# EAGLE schematic EEprog (EAGLE 7.0.0)
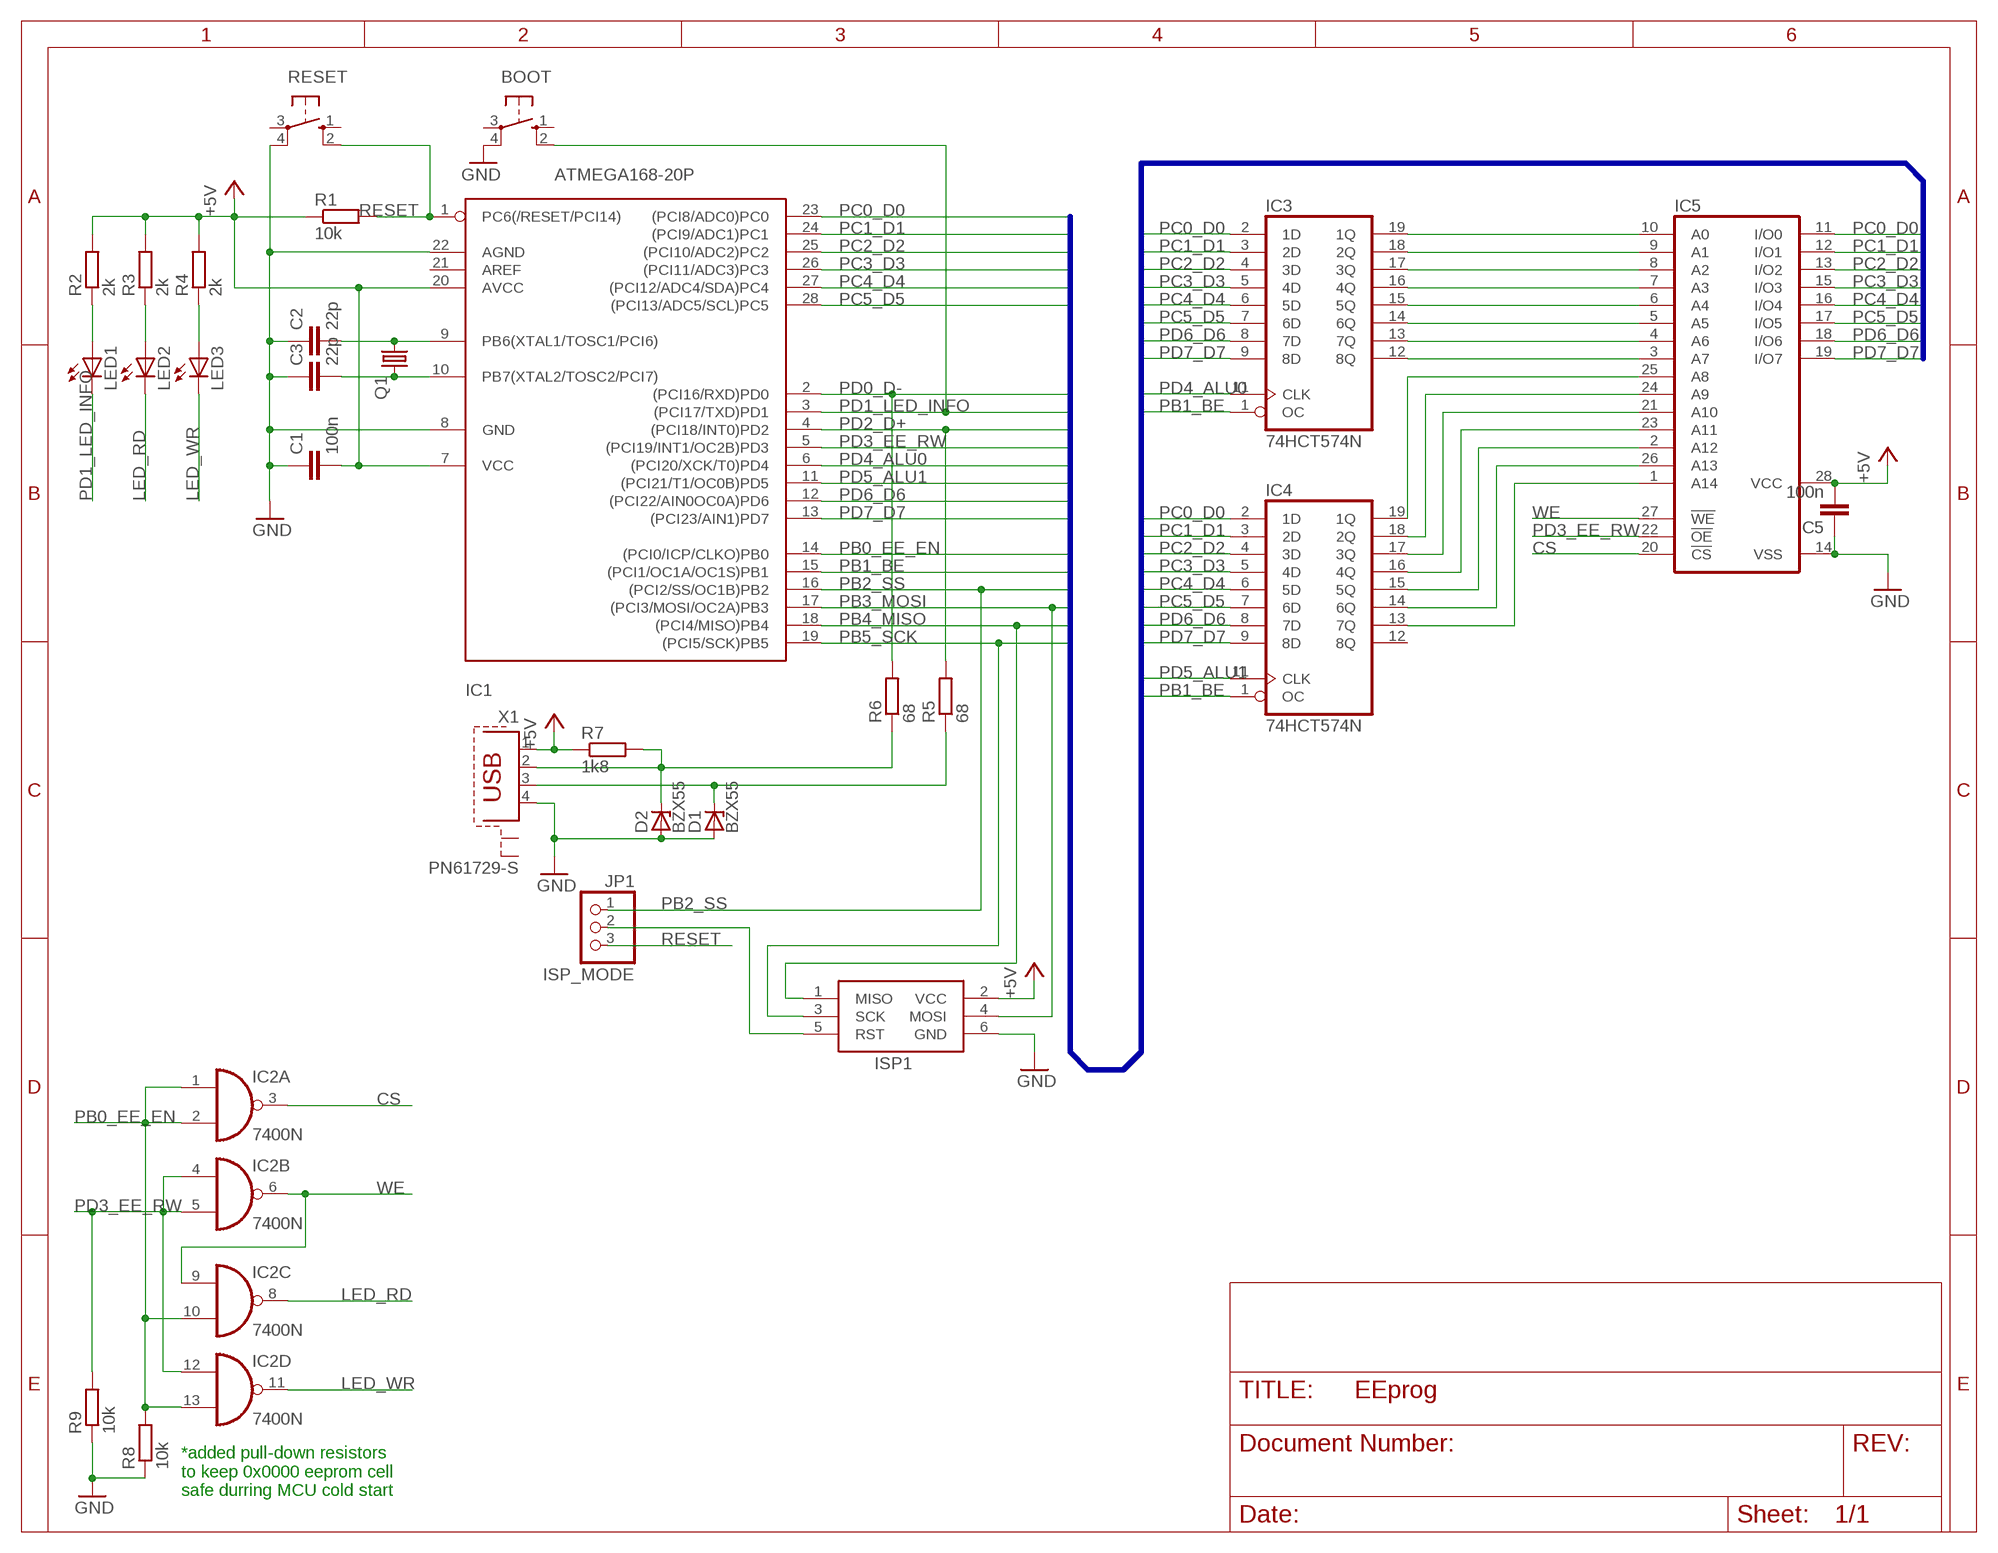
[diagram p0: schematic, sheet 1]

## Parts
BOOT  10-XX  [B3F-10XX]
C1  100n  C-EU025-025X050  [C025-025X050]
C2  22p  C-EU025-025X050  [C025-025X050]
C3  22p  C-EU025-025X050  [C025-025X050]
C5  100n  C-EU025-025X050  [C025-025X050]
D1  BZX55  [DO35Z10]
D2  BZX55  [DO35Z10]
IC1  ATMEGA168-20P  [DIL28-3]
IC2  7400N  [DIL14]
IC3  74HCT574N  [DIL20]
IC4  74HCT574N  [DIL20]
IC5  62256P  [DIL28-6]
ISP1  AVRISP-BOX  [AVRISP-BOX]
JP1  ISP_MODE  PINHD-1X3  [1X03]
LED1  LED3MM  [LED3MM]
LED2  LED3MM  [LED3MM]
LED3  LED3MM  [LED3MM]
Q1  CRYSTALHC49S  [HC49/S]
R1  10k  R-EU_0204/7  [0204/7]
R2  2k  R-EU_0204/7  [0204/7]
R3  2k  R-EU_0204/7  [0204/7]
R4  2k  R-EU_0204/7  [0204/7]
R5  68  R-EU_0204/7  [0204/7]
R6  68  R-EU_0204/7  [0204/7]
R7  1k8  R-EU_0204/7  [0204/7]
R8  10k  R-EU_0204/7  [0204/7]
R9  10k  R-EU_0204/7  [0204/7]
RESET  10-XX  [B3F-10XX]
X1  PN61729-S  [PN61729-S]

## Nets
+5V: C1.2 C5.2 IC1.7(VCC) IC1.20(AVCC) IC5.28(VCC) ISP1.2(VCC) R1.1 R2.2 R3.2 R4.2 R7.1 X1.1
CS: IC2.3(A:O) IC5.20(!CS)
GND: BOOT.4(P1) C1.1 C2.1 C3.1 C5.1 D1.A D2.A IC1.8(GND) IC1.22(AGND) IC5.14(VSS) ISP1.6(GND) R8.1 R9.1 RESET.4(P1) X1.4
LED_RD: IC2.8(C:O) LED2.K(C)
LED_WR: IC2.11(D:O) LED3.K(C)
N$1: IC3.19(1Q) IC5.10(A0)
N$2: IC3.18(2Q) IC5.9(A1)
N$3: IC3.17(3Q) IC5.8(A2)
N$4: IC3.16(4Q) IC5.7(A3)
N$5: IC3.15(5Q) IC5.6(A4)
N$6: IC3.14(6Q) IC5.5(A5)
N$7: IC3.13(7Q) IC5.4(A6)
N$8: IC3.12(8Q) IC5.3(A7)
N$9: IC4.19(1Q) IC5.25(A8)
N$10: IC4.18(2Q) IC5.24(A9)
N$11: IC4.17(3Q) IC5.21(A10)
N$12: IC4.16(4Q) IC5.23(A11)
N$13: IC4.15(5Q) IC5.2(A12)
N$14: IC4.14(6Q) IC5.26(A13)
N$15: IC4.13(7Q) IC5.1(A14)
N$16: D2.C R6.1 R7.2 X1.2
N$17: LED1.A R2.1
N$18: C2.2 IC1.9(PB6(XTAL1/TOSC1/PCI6)) Q1.1
N$19: C3.2 IC1.10(PB7(XTAL2/TOSC2/PCI7)) Q1.2
N$20: ISP1.5(RST) JP1.2
N$21: D1.C R5.1 X1.3
N$22: LED2.A R3.1
N$24: LED3.A R4.1
PB0_EE_EN: IC1.14((PCI0/ICP/CLKO)PB0) IC2.1(A:I0) IC2.2(A:I1) IC2.10(C:I1) IC2.13(D:I1) R8.2
PB1_BE: IC1.15((PCI1/OC1A/OC1S)PB1) IC3.1(OC) IC4.1(OC)
PB2_SS: IC1.16((PCI2/SS/OC1B)PB2) JP1.1
PB3_MOSI: IC1.17((PCI3/MOSI/OC2A)PB3) ISP1.4(MOSI)
PB4_MISO: IC1.18((PCI4/MISO)PB4) ISP1.1(MISO)
PB5_SCK: IC1.19((PCI5/SCK)PB5) ISP1.3(SCK)
PC0_D0: IC1.23((PCI8/ADC0)PC0) IC3.2(1D) IC4.2(1D) IC5.11(I/O0)
PC1_D1: IC1.24((PCI9/ADC1)PC1) IC3.3(2D) IC4.3(2D) IC5.12(I/O1)
PC2_D2: IC1.25((PCI10/ADC2)PC2) IC3.4(3D) IC4.4(3D) IC5.13(I/O2)
PC3_D3: IC1.26((PCI11/ADC3)PC3) IC3.5(4D) IC4.5(4D) IC5.15(I/O3)
PC4_D4: IC1.27((PCI12/ADC4/SDA)PC4) IC3.6(5D) IC4.6(5D) IC5.16(I/O4)
PC5_D5: IC1.28((PCI13/ADC5/SCL)PC5) IC3.7(6D) IC4.7(6D) IC5.17(I/O5)
PD0_D-: IC1.2((PCI16/RXD)PD0) R6.2
PD1_LED_INFO: BOOT.2(S1) IC1.3((PCI17/TXD)PD1) LED1.K(C)
PD2_D+: IC1.4((PCI18/INT0)PD2) R5.2
PD3_EE_RW: IC1.5((PCI19/INT1/OC2B)PD3) IC2.4(B:I0) IC2.5(B:I1) IC2.12(D:I0) IC5.22(!OE) R9.2
PD4_ALU0: IC1.6((PCI20/XCK/T0)PD4) IC3.11(CLK)
PD5_ALU1: IC1.11((PCI21/T1/OC0B)PD5) IC4.11(CLK)
PD6_D6: IC1.12((PCI22/AIN0OC0A)PD6) IC3.8(7D) IC4.8(7D) IC5.18(I/O6)
PD7_D7: IC1.13((PCI23/AIN1)PD7) IC3.9(8D) IC4.9(8D) IC5.19(I/O7)
RESET: IC1.1(PC6(/RESET/PCI14)) JP1.3 R1.2 RESET.2(S1)
WE: IC2.6(B:O) IC2.9(C:I0) IC5.27(!WE)
Unconnected: BOOT.1(S) BOOT.3(P) IC1.21(AREF) IC4.12(8Q) RESET.1(S) RESET.3(P) X1.S1 X1.S2

## Buses
D[0..7],CE,OE,WE,PB[0..5],PC[0..5],PD[0..7],ALU0,ALU1

## Notes on the sheet
- *added pull-down resistors 
  to keep 0x0000 eeprom cell
  safe durring MCU cold start

## Power pins joined to a net without a drawn wire
GND: IC2.7(P:GND) IC3.10(GND) IC4.10(GND)
VCC: IC2.14(P:VCC) IC3.20(VCC) IC4.20(VCC)

## Library data of the parts
BOOT RESET = switch-omron:10-XX: OMRON SWITCH; MPN: B3F-1000; OC_FARNELL: 176432; OC_NEWARK: 36M3542
C1-C3 C5 = resistor:C-EU: CAPACITOR, European symbol
D1 D2 = diode:BZX55: Z DIODE
IC1 = adafruit:ATMEGA168*P: MICROCONTROLLER 16 kBytes FLASH 1 kBytes SRAM 512 Bytes EEPROM USART 8-channel 10 bit ADC
IC2 = 74xx-eu:74*00: Quad 2-input NAND gate
IC3 IC4 = 74xx-eu:74*574: 8-bit D type FLIP FLOP bus driver
IC5 = memory-hitachi:62256P: MEMORY; OC_FARNELL: unknown; OC_NEWARK: unknown
ISP1 = adafruit:AVRISP: AVR ISP HEADER Standard 6 pin header for AVR programming
JP1 = pinhead:PINHD-1X3: PIN HEADER
LED1-LED3 = led:LED: LED OSRAM: - CHIPLED LG R971, LG N971, LY N971, LG Q971, LY Q971, LO R971, LY R971 LH N974, LH R974 LS Q976, LO Q976, LY Q976 LO Q996 - Hyper CHIPLED LW Q18S LB Q993, LB Q99A, LB R99A - SideLED LS A670, LO A670, LY A670, LG A670, LP A670 LB A673, LV A673, LT A673, LW A673 LH A674 LY A675 LS A676, LA A676, LO A676, LY A676, LW A676 LS A679, LY A679, LG A679 - Hyper Micro SIDELED® LS Y876, LA Y876, LO Y876, LY Y876 LT Y87S - SmartLED LW L88C, LW L88S LB L89C, LB L89S, LG L890 LS L89K, LO L89K, LY L89K LS L896, LA L896, LO L896, LY L896 - TOPLED LS T670, LO T670, LY T670, LG T670, LP T670 LSG T670, LSP T670, LSY T670, LOP T670, LYG T670 LG T671, LOG T671, LSG T671 LB T673, LV T673, LT T673, LW T673 LH T674 LS T676, LA T676, LO T676, LY T676, LB T676, LH T676, LSB T676, LW T676 LB T67C, LV T67C, LT T67C, LS T67K, LO T67K, LY T67K, LW E67C LS E67B, LA E67B, LO E67B, LY E67B, LB E67C, LV E67C, LT E67C LW T67C LS T679, LY T679, LG T679 LS T770, LO T770, LY T770, LG T770, LP T770 LB T773, LV T773, LT T773, LW T773 LH T774 LS E675, LA E675, LY E675, LS T675 LS T776, LA T776, LO T776, LY T776, LB T776 LHGB T686 LT T68C, LB T68C - Hyper Mini TOPLED® LB M676 - Mini TOPLED Santana® LG M470 LS M47K, LO M47K, LY M47K Source: http://www.osram.convergy.de LUXEON: - LUMILED® LXK2-PW12-R00, LXK2-PW12-S00, LXK2-PW14-U00, LXK2-PW14-V00 LXK2-PM12-R00, LXK2-PM12-S00, LXK2-PM14-U00 LXK2-PE12-Q00, LXK2-PE12-R00, LXK2-PE12-S00, LXK2-PE14-T00, LXK2-PE14-U00 LXK2-PB12-K00, LXK2-PB12-L00, LXK2-PB12-M00, LXK2-PB14-N00, LXK2-PB14-P00, LXK2-PB14-Q00 LXK2-PR12-L00, LXK2-PR12-M00, LXK2-PR14-Q00, LXK2-PR14-R00 LXK2-PD12-Q00, LXK2-PD12-R00, LXK2-PD12-S00 LXK2-PH12-R00, LXK2-PH12-S00 LXK2-PL12-P00, LXK2-PL12-Q00, LXK2-PL12-R00 Source: www.luxeon.com KINGBRIGHT: KA-3528ASYC Source: www.kingbright.com
Q1 = crystal:CRYSTAL: CRYSTAL; OC_FARNELL: 1667008; OC_NEWARK: unknown
R1-R9 = resistor:R-EU_: RESISTOR, European symbol
X1 = con-berg:PN61729-S: BERG USB connector; OC_FARNELL: unknown; OC_NEWARK: unknown